# Altium schematic sheet PV_MCU_IO2.SchDoc
size A
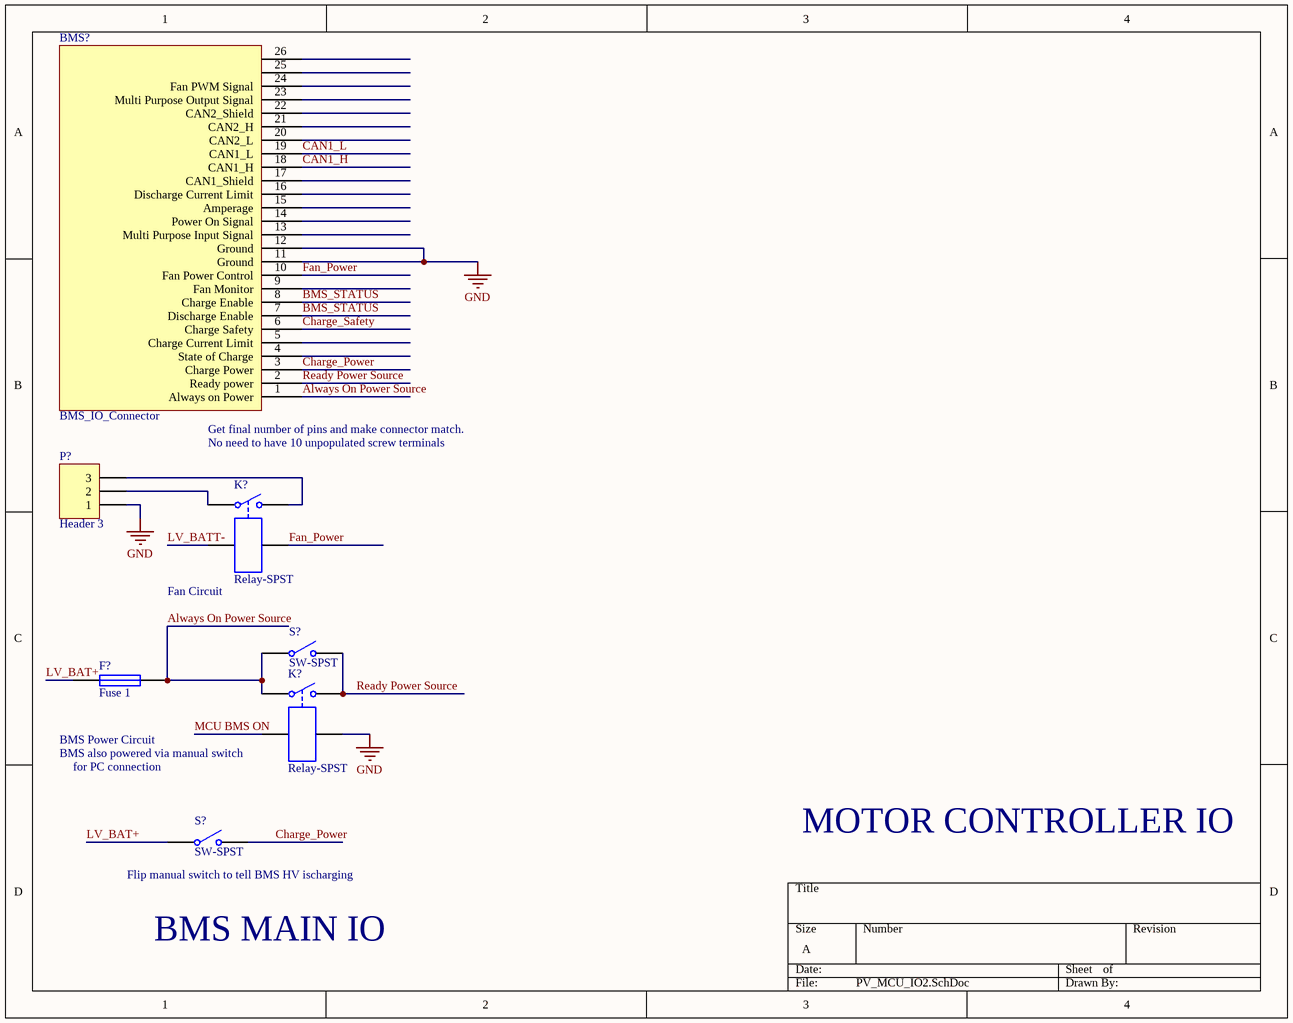
[diagram p0: PV_MCU_IO2.SchDoc]

## Parts
(Parts that share a designator on the sheet are numbered #1, #2 ... from top to bottom, then left to right.)
BMS?  BMS_IO_Connector
F?  Fuse 1  [1A FUSE HOLDER]
K?#1  Relay-SPST  [MODULE4]
K?#2  Relay-SPST  [MODULE4]
P?  Header 3  [HDR1X3]
S?#1  SW-SPST  [SPST-2]
S?#2  SW-SPST  [SPST-2]

## Nets
GND: BMS?.11(Ground) BMS?.12(Ground) K?#2.4 P?.1
Always On Power Source: BMS?.1(Always_on_Power) F?.1 K?#2.1 S?#1.1(COMMON)
BMS_STATUS: BMS?.7(Discharge_Enable) BMS?.8(Charge_Enable)
CAN1_H: BMS?.18(CAN1_H)
CAN1_L: BMS?.19(CAN1_L)
Charge_Power: BMS?.3(Charge_Power) S?#2.2(NO)
Charge_Safety: BMS?.6(Charge_Safety)
Fan_Power: BMS?.10(Fan_Power_Control) K?#1.4
LV_BAT+: F?.2 S?#2.1(COMMON)
LV_BATT-: K?#1.3
MCU BMS ON: K?#2.3
Ready Power Source: BMS?.2(Ready_power) K?#2.2 S?#1.2(NO)
NetK?#1_1: K?#1.1 P?.2
NetK?#1_2: K?#1.2 P?.3

Not connected (* = marked no-connect by the designer): BMS? 4(State_of_Charge) 5(Charge_Current_Limit) 9(Fan_Monitor) 13(Multi_Purpose_Input_Signal) 14(Power_On_Signal) 15(Amperage) 16(Discharge_Current_Limit) 17(CAN1_Shield) 20(CAN2_L) 21(CAN2_H) 22(CAN2_Shield) 23(Multi_Purpose_Output_Signal) 24(Fan_PWM_Signal) 25 26

## Notes on the sheet
- (near BMS?) Get final number of pins and make connector match.
- No need to have 10 unpopulated screw terminals
- (near K?#1) Fan Circuit
- BMS Power Circuit
- (near K?#2) BMS also powered via manual switch
- for PC connection
- MOTOR CONTROLLER IO
- (near S?#2) Flip manual switch to tell BMS HV ischarging
- BMS MAIN IO

## Library data of the parts
F? = Fuse 1: Fuse; Published: 8-Jun-2000; LatestRevisionDate: 17-Jul-2002; LatestRevisionNote: Re-released for DXP Platform.; PackageReference: PIN-W2/E2.8; Publisher: Altium Limited; PackageDescription: Thru-Hole; 2 Leads; ComponentLink1Description: Digikey- FUSE; ComponentLink1URL: https://www.digikey.com/product-detail/en/littelfuse-inc/0451001.MRL/F2577CT-ND/813055; ComponentLink2Description: Digikey - Holder; ComponentLink2URL: https://www.digikey.com/product-detail/en/littelfuse-inc/0154001.DR/F1222TR-ND/183352
K?#1 K?#2 = Relay-SPST: Single-Pole Single-Throw Relay; Published: 24-Mar-1999; LatestRevisionDate: 17-Jul-2002; LatestRevisionNote: Re-released for DXP Platform.; PackageReference: MODULE4; Publisher: Altium Limited
P? = Header 3: Header, 3-Pin; LatestRevisionDate: 17-Jul-2002; LatestRevisionNote: Re-released for DXP Platform.; Publisher: Altium Limited
S?#1 S?#2 = SW-SPST: Single-Pole, Single-Throw Switch; Published: 24-Mar-1999; LatestRevisionDate: 17-Jul-2002; LatestRevisionNote: Re-released for DXP Platform.; PackageReference: SPST-2; Publisher: Altium Limited; PackageDescription: Switch; 2 Leads